# EAGLE design Console Main Ctl Board (EAGLE 9.6.2)
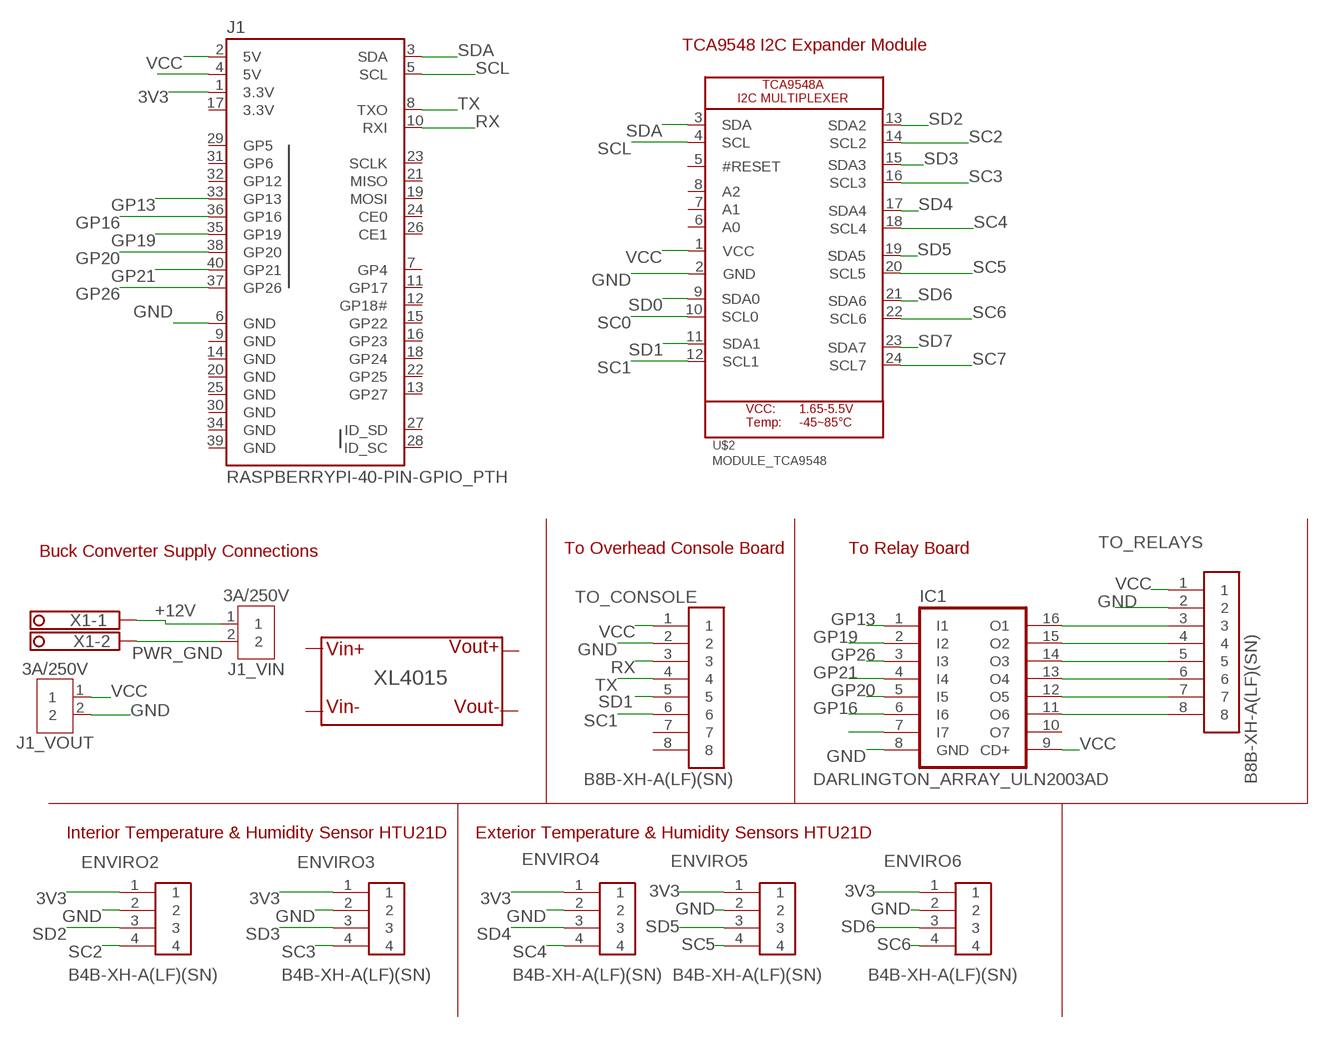
[diagram p0: schematic, sheet 1]

## Parts
ENVIRO2  B4B-XH-A(LF)(SN)  [B4B-XH-A(LF)(SN)]
ENVIRO3  B4B-XH-A(LF)(SN)  [B4B-XH-A(LF)(SN)]
ENVIRO4  B4B-XH-A(LF)(SN)  [B4B-XH-A(LF)(SN)]
ENVIRO5  B4B-XH-A(LF)(SN)  [B4B-XH-A(LF)(SN)]
ENVIRO6  B4B-XH-A(LF)(SN)  [B4B-XH-A(LF)(SN)]
IC1  DARLINGTON_ARRAY_ULN2003AD  [SO16]
J1  RASPBERRYPI-40-PIN-GPIO_PTH  [2X20_SHROUDED]
J1_VIN  3A/250V  B2B-XH-A  [B2B-XH-A]
J1_VOUT  3A/250V  B2B-XH-A  [B2B-XH-A]
TO_CONSOLE  B8B-XH-A(LF)(SN)  [B8B-XH-A(LF)(SN)]
TO_RELAYS  B8B-XH-A(LF)(SN)  [B8B-XH-A(LF)(SN)]
U$1  XL4015-MODULE  [XL4015-MODULE]
U$2  MODULE_TCA9548  [MODULE_TCA9548A]
X1  TERMINAL-BLOCK-3.5MM-2-PIN-LONG-PAD  [TERMINAL-BLOCK-2-PIN-3.5MM-LONG-PAD]

## Nets
3V3: ENVIRO2.1 ENVIRO3.1 ENVIRO4.1 ENVIRO5.1 ENVIRO6.1 J1.1(3.3V)
+12V: J1_VIN.1 X1.1
GND: ENVIRO2.2 ENVIRO3.2 ENVIRO4.2 ENVIRO5.2 ENVIRO6.2 IC1.8(GND) J1.6(GND) J1_VOUT.2 TO_CONSOLE.2 TO_RELAYS.2 U$2.2(GND)
GP13: IC1.1(I1) J1.33(GP13)
GP16: IC1.6(I6) J1.36(GP16)
GP19: IC1.2(I2) J1.35(GP19)
GP20: IC1.5(I5) J1.38(GP20)
GP21: IC1.4(I4) J1.40(GP21)
GP26: IC1.3(I3) J1.37(GP26)
N$2: J1.4(5V)
N$3: IC1.16(O1) TO_RELAYS.3
N$4: IC1.15(O2) TO_RELAYS.4
N$5: IC1.14(O3) TO_RELAYS.5
N$6: IC1.7(I7)
N$7: IC1.13(O4) TO_RELAYS.6
N$8: IC1.12(O5) TO_RELAYS.7
N$9: IC1.11(O6) TO_RELAYS.8
PWR_GND: J1_VIN.2 X1.2
RX: J1.10(RXI) TO_CONSOLE.3
SC0: U$2.10(SCL0)
SC1: TO_CONSOLE.6 U$2.12(SCL1)
SC2: ENVIRO2.4 U$2.14(SCL2)
SC3: ENVIRO3.4 U$2.16(SCL3)
SC4: ENVIRO4.4 U$2.18(SCL4)
SC5: ENVIRO5.4 U$2.20(SCL5)
SC6: ENVIRO6.4 U$2.22(SCL6)
SC7: U$2.24(SCL7)
SCL: J1.5(SCL) U$2.4(SCL)
SD0: U$2.9(SDA0)
SD1: TO_CONSOLE.5 U$2.11(SDA1)
SD2: ENVIRO2.3 U$2.13(SDA2)
SD3: ENVIRO3.3 U$2.15(SDA3)
SD4: ENVIRO4.3 U$2.17(SDA4)
SD5: ENVIRO5.3 U$2.19(SDA5)
SD6: ENVIRO6.3 U$2.21(SDA6)
SD7: U$2.23(SDA7)
SDA: J1.3(SDA) U$2.3(SDA)
TX: J1.8(TXO) TO_CONSOLE.4
VCC: IC1.9(CD+) J1.2(5V) J1_VOUT.1 TO_CONSOLE.1 TO_RELAYS.1 U$2.1(VCC)
Unconnected: IC1.10(O7) J1.7(GP4) J1.11(GP17) J1.12(GP18#) J1.13(GP27) J1.15(GP22) J1.16(GP23) J1.18(GP24) J1.19(MOSI) J1.21(MISO) J1.22(GP25) J1.23(SCLK) J1.24(CE0) J1.26(CE1) J1.27(ID_SD) J1.28(ID_SC) J1.29(GP5) J1.31(GP6) J1.32(GP12) TO_CONSOLE.7 TO_CONSOLE.8 U$1.P$1(IN+) U$1.P$2(IN-) U$1.P$3(OUT+) U$1.P$4(OUT-) U$2.5(#RESET) U$2.6(A0) U$2.7(A1) U$2.8(A2)

## Notes on the sheet
- TCA9548 I2C Expander Module
- Buck Converter Supply Connections | To Overhead Console Board | To Relay Board
- Interior Temperature & Humidity Sensor HTU21D | Exterior Temperature & Humidity Sensors HTU21D

## Power pins joined to a net without a drawn wire
3.3V: J1.17(3.3V)
GND: J1.9(GND) J1.14(GND) J1.20(GND) J1.25(GND) J1.30(GND) J1.34(GND) J1.39(GND)

## Library data of the parts
ENVIRO2-ENVIRO6 = Headers:B4B-XH-A(LF)(SN): CONN HEADER VERT 4POS 2.5MM Manufacturer's datasheet <http://www.jst-mfg.com/product/pdf/eng/eXH.pdf>; CREATED_BY: PCBLayout.com; DIGIKEY_PARTNO: 455-2249-ND; MANUFACTURER: JST Sales America Inc.; MPN: B4B-XH-A(LF)(SN)
IC1 = Nathan Custom:DARLINGTON_ARRAY_ULN2003A: DRIVER ARRAY
J1 = SparkFun-Connectors:RASPBERRYPI-40-PIN-GPIO: Raspberry Pi GPIO Header 2x20 pin connector, as found on B, B+, A+ models. Both shrouded PTH and SMT versions available. SparkFun Products: GPIO Shrouded Header <https://www.sparkfun.com/products/13054>- PTH SparkFun Pi Wedge (Preassembled) <https://www.sparkfun.com/products/13717>; PROD_ID: CONN-12263; SF_ID: PRT-13054
J1_VIN J1_VOUT = Connector:B2B-XH-A: XH Connector Top Entry - 2POS Details see: Datasheet <http://www.jst-mfg.com/product/pdf/eng/eXH.pdf>; CATEGORY: CONNECTOR; DESCRIPTION: 2.5mm pitch/disconnectable crimp style connector; MANUFACTURER: JST (XH CONNECTOR); MPN: B2B-XH-A; OPERATING_TEMPERATURE: -25°C ~ 85°C; PART_STATUS: ACTIVE; ROHS_COMPLIANT: COMPLIANT; SERIES: B_B-XH-A; SUB_CATEGORY: Through hole connector; TYPE: top entry
TO_CONSOLE TO_RELAYS = Headers:B8B-XH-A(LF)(SN): CONN HEADER VERT 8POS 2.5MM Manufacturer's datasheet <http://www.jst-mfg.com/product/pdf/eng/eXH.pdf>; CREATED_BY: PCBLayout.com; DIGIKEY_PARTNO: 455-2251-ND; MANUFACTURER: JST Sales America Inc.; MPN: B8B-XH-A(LF)(SN)
U$1 = Nathan Custom:XL4015-MODULE
U$2 = Nathan Custom:MODULE_TCA9548
X1 = Rembrandt Electronics - Terminal Block 3-5mm v1-0:TERMINAL-BLOCK-3.5MM-2-PIN: Terminal Block 3.5mm Pitch: 3,5 mm Number of pins: 2 Created by Rembrandt Electronics www.rembrandtelectronics.com

## Net classes
1 highpower: width 0.305 mm, drill 0.483 mm
2 lowpower: width 0.254 mm, drill 0.483 mm

## Board
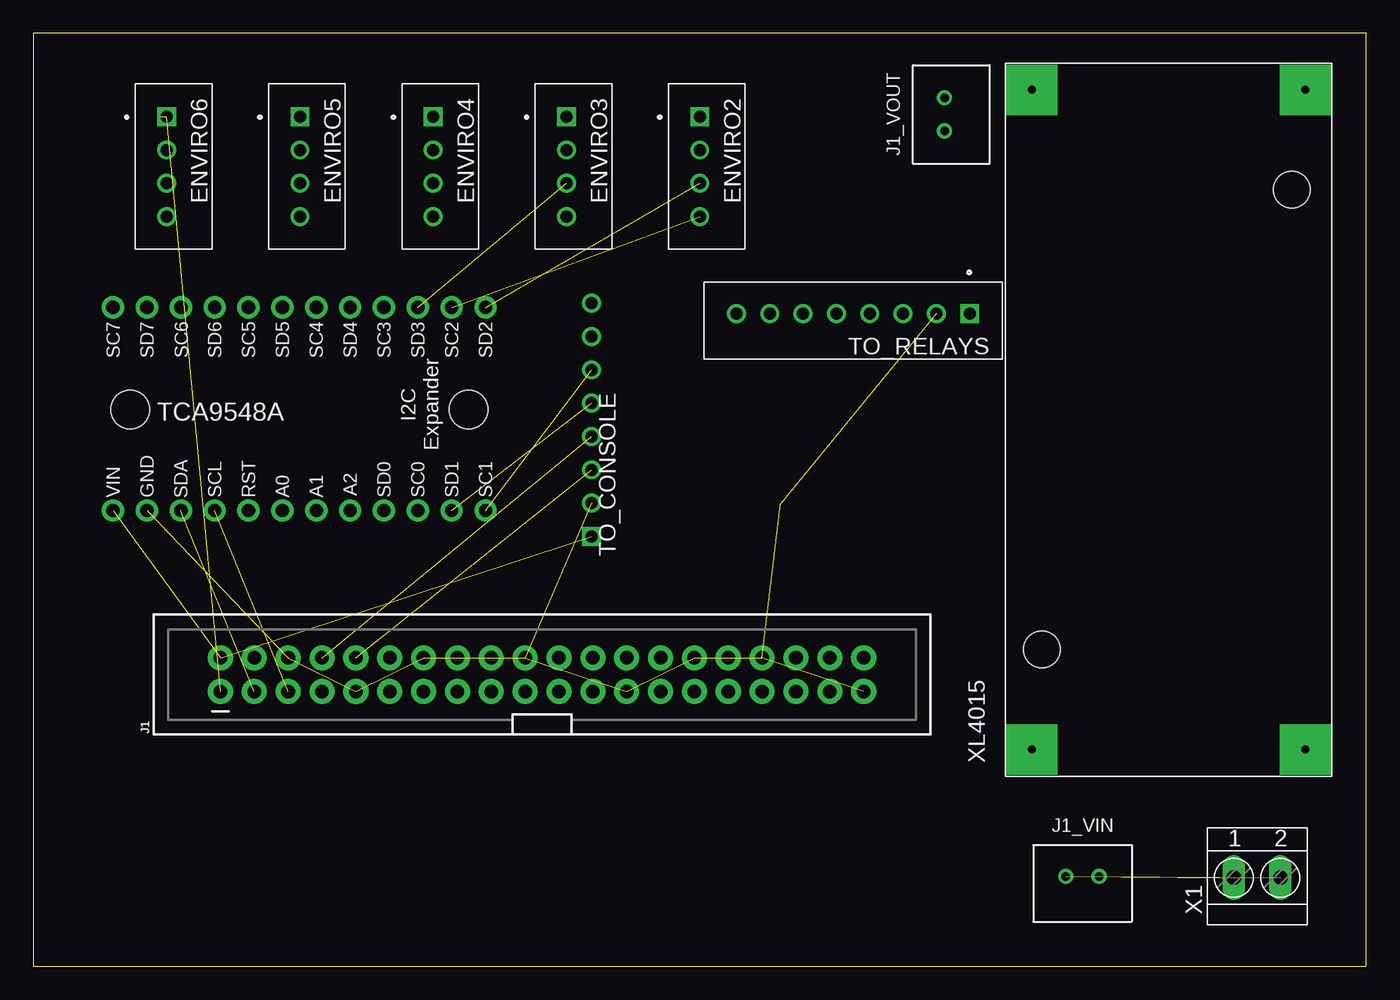
[diagram p1: board, top side]
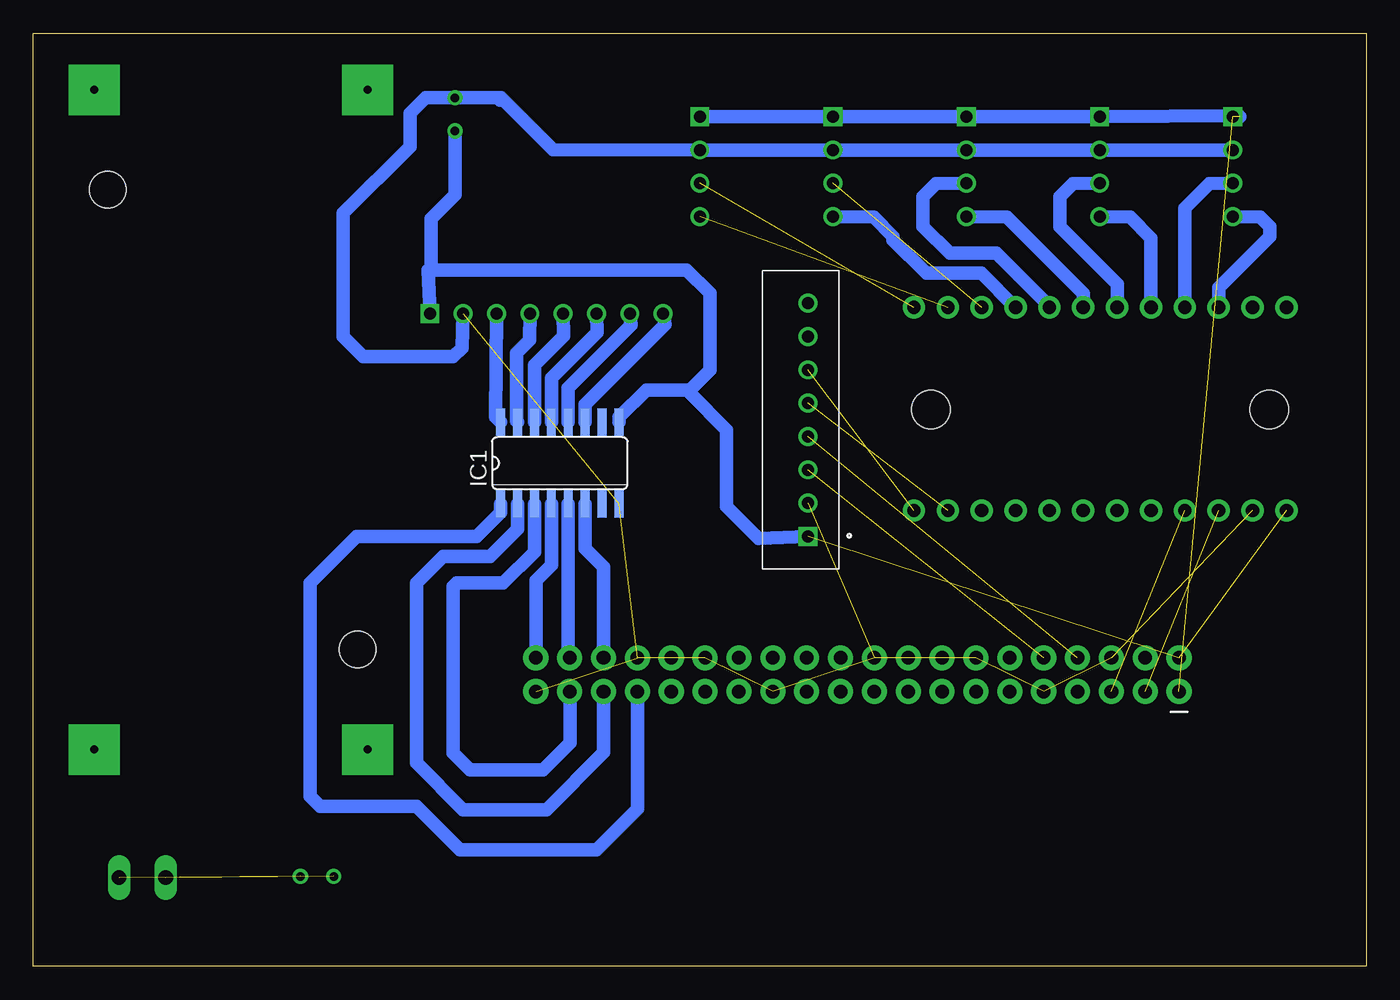
[diagram p2: board, bottom side, seen from below]

Size 100 x 70 mm. Coordinates in mm from the lower left corner, seen from the top.
Outline: 0,0 100,0 100,70 0,70 0,0
Copper layers (1*16): Top 0.035mm / dielectric 1.5mm / Bottom 0.035mm
Design rules "default *": minimum track width 6mil, minimum drill 0.35mm, track to track 6mil, track to pad 6mil, pad to pad 6mil, via to via 6mil, smd to smd 6mil, copper to edge 1mil, drill to drill 6mil, minimum pad ring 10mil, minimum via ring 8mil, stop-mask expansion 2mil, vias tented up to drill 0mil, thermal gap 10mil

### Footprints (pad centres in the part's own frame; a part is rotated, then mirrored left to right if it is on the bottom)
B4B-XH-A(LF)(SN) = drill 0.9 square: 1 -3.75,0 | drill 0.9: 2 -1.25,0; 3 1.25,0; 4 3.75,0
SO16 = smd 0.66 x 2.032: 1 -4.445,-3.073; 2 -3.175,-3.073; 3 -1.905,-3.073; 4 -0.635,-3.073; 5 0.635,-3.073; 6 1.905,-3.073; 7 3.175,-3.073; 8 4.445,-3.073; 9 4.445,3.073; 10 3.175,3.073; 11 1.905,3.073; 12 0.635,3.073; 13 -0.635,3.073; 14 -1.905,3.073; 15 -3.175,3.073; 16 -4.445,3.073
2X20_SHROUDED = drill 1.016 pad 1.88: 1 -1.27,24.13; 2 1.27,24.13; 3 -1.27,21.59; 4 1.27,21.59; 5 -1.27,19.05; 6 1.27,19.05; 7 -1.27,16.51; 8 1.27,16.51; 9 -1.27,13.97; 10 1.27,13.97; 11 -1.27,11.43; 12 1.27,11.43; 13 -1.27,8.89; 14 1.27,8.89; 15 -1.27,6.35; 16 1.27,6.35; 17 -1.27,3.81; 18 1.27,3.81; 19 -1.27,1.27; 20 1.27,1.27; 21 -1.27,-1.27; 22 1.27,-1.27; 23 -1.27,-3.81; 24 1.27,-3.81; 25 -1.27,-6.35; 26 1.27,-6.35; 27 -1.27,-8.89; 28 1.27,-8.89; 29 -1.27,-11.43; 30 1.27,-11.43; 31 -1.27,-13.97; 32 1.27,-13.97; 33 -1.27,-16.51; 34 1.27,-16.51; 35 -1.27,-19.05; 36 1.27,-19.05; 37 -1.27,-21.59; 38 1.27,-21.59; 39 -1.27,-24.13; 40 1.27,-24.13
B2B-XH-A = drill 0.64: 1 0,0; 2 2.5,0
B8B-XH-A(LF)(SN) = drill 0.9 square: 1 -8.75,0 | drill 0.9: 2 -6.25,0; 3 -3.75,0; 4 -1.25,0; 5 1.25,0; 6 3.75,0; 7 6.25,0; 8 8.75,0
XL4015-MODULE = drill 0.6 pad 3.81 square: P$1 2,22.5; P$2 2,2; P$3 51.5,22.5; P$4 51.5,2 | hole 2.75: 9.5,21.75; 44,3
MODULE_TCA9548A = drill 1 pad 1.676: 1 -7.696,14.859; 2 -7.696,12.319; 3 -7.696,9.779; 4 -7.696,7.239; 5 -7.696,4.699; 6 -7.696,2.159; 7 -7.696,-0.381; 8 -7.696,-2.921; 9 -7.696,-5.461; 10 -7.696,-8.001; 11 -7.696,-10.541; 12 -7.696,-13.081; 13 7.544,-13.081; 14 7.544,-10.541; 15 7.544,-8.001; 16 7.544,-5.461; 17 7.544,-2.921; 18 7.544,-0.381; 19 7.544,2.159; 20 7.544,4.699; 21 7.544,7.239; 22 7.544,9.779; 23 7.544,12.319; 24 7.544,14.859 | hole 2.9: -0.127,-11.811; -0.127,13.589
TERMINAL-BLOCK-2-PIN-3.5MM-LONG-PAD = drill 1.1 pad 1.7 long: 1 -1.75,-0.1; 2 1.75,-0.1

### Placement (x,y rotation side)
ENVIRO2  50,60 270 top
ENVIRO3  40,60 270 top
ENVIRO4  30,60 270 top
ENVIRO5  20,60 270 top
ENVIRO6  10,60 270 top
IC1  60.5,37.75 0 bottom
J1  38.17,21.88 90 top
J1_VIN  77.46,6.74 0 top
J1_VOUT  68.36,62.66 90 top
TO_CONSOLE  41.89,41 90 bottom
TO_RELAYS  61.5,48.97 180 top
U$1  97.42,14.25 90 top
U$2  20.85,41.89 90 top
X1  91.82,6.74 0 top

### Tracks (layer width: path | path; a pad name or v marks a point on that pad's centre or on a via)
3V3  (2 unrouted)
  Bottom 1.016: ENVIRO2.1 ENVIRO3.1 ENVIRO4.1 ENVIRO5.1 9.56,63.81 9.5,63.75
+12V  (1 unrouted)
GND  (11 unrouted)
  Bottom 1.016: TO_RELAYS.2 67.85,46.4 68.5,45.75 75.25,45.75 76.75,47.25 76.75,56.5 71.75,61.5 71.75,64 70.59,65.16 J1_VOUT.2 65.16,65.16 | 65.16,65.16 65,65 | 65.16,65.16 64.91,65.16 61.02,61.27 ENVIRO2.2 ENVIRO3.2 ENVIRO4.2 ENVIRO5.2 ENVIRO6.2
GP13
  Bottom 1.016: IC1.1 64.94,34.05 66.75,32.25 75.75,32.25 79.25,28.75 79.25,12.75 78.5,12 71.25,12 68,8.75 57.75,8.75 54.68,11.82 J1.33
GP16
  Bottom 1.016: IC1.6 58.59,31.34 57.22,29.97 57.22,27.32 J1.36
GP19
  Bottom 1.016: J1.35 57.22,16.03 61.5,11.75 67.75,11.75 71.25,15.25 71.25,28.75 69.25,30.75 65.75,30.75 63.67,32.83 IC1.2
GP20
  Bottom 1.016: IC1.5 59.87,23.25 J1.38
GP21
  Bottom 1.016: IC1.4 61.13,30.11 62.3,28.95 J1.40
GP26
  Bottom 1.016: IC1.3 62.41,31.09 64.75,28.75 68.25,28.75 68.5,28.5 68.5,16 67.25,14.75 61.75,14.75 59.75,16.75 59.75,20.6 J1.37
N$3
  Bottom 1.016: TO_RELAYS.3 65.31,41.19 IC1.16
N$4
  Bottom 1.016: TO_RELAYS.4 62.77,46.98 63.75,46 63.75,40.9 IC1.15
N$5
  Bottom 1.016: TO_RELAYS.5 60.23,47.27 62.41,45.09 IC1.14
N$7
  Bottom 1.016: TO_RELAYS.6 57.69,47.56 61.13,44.12 IC1.13
N$8
  Bottom 1.016: TO_RELAYS.7 55.15,48.1 59.87,43.38 IC1.12
N$9
  Bottom 1.016: TO_RELAYS.8 52.61,48.14 58.59,42.16 IC1.11
PWR_GND  (1 unrouted)
RX  (1 unrouted)
SC1  (1 unrouted)
SC2  (1 unrouted)
SC3
  Bottom 1.016: U$2.16 28.87,52 33,52 35.5,54.5 35.5,54.75 36.94,56.19 ENVIRO3.4
SC4
  Bottom 1.016: U$2.18 21.23,50.48 26.94,56.19 ENVIRO4.4
SC5
  Bottom 1.016: ENVIRO5.4 17.69,56.19 16.15,54.65 U$2.20
SC6
  Bottom 1.016: ENVIRO6.4 7.94,56.19 7.25,55.5 7.25,54.75 11.07,50.93 U$2.22
SCL  (1 unrouted)
SD1  (1 unrouted)
SD2  (1 unrouted)
SD3  (1 unrouted)
SD4
  Bottom 1.016: U$2.17 23.77,49.52 27.75,53.5 31.25,53.5 33.25,55.5 33.25,57.75 32.27,58.73 ENVIRO4.3
SD5
  Bottom 1.016: ENVIRO5.3 22.02,58.73 23,57.75 23,55.5 18.69,51.19 U$2.19
SD6
  Bottom 1.016: ENVIRO6.3 11.77,58.73 13.61,56.89 U$2.21
SDA  (1 unrouted)
TX  (1 unrouted)
VCC  (2 unrouted)
  Bottom 1.016: J1_VOUT.1 68.36,57.89 70.14,56.11 70.14,52.25 | TO_RELAYS.1 70.39,52.25 70.14,52.25 | 50.75,43.25 49.25,44.75 49.25,50.5 51,52.25 70.14,52.25 | 50.75,43.25 54,43.25 56.05,41.2 IC1.9 | 50.75,43.25 50.75,43 48,40.25 48,34.5 45.61,32.11 TO_CONSOLE.1